# Altium schematic sheet SCH-9-Battery Voltage Indicators.SchDoc
size B
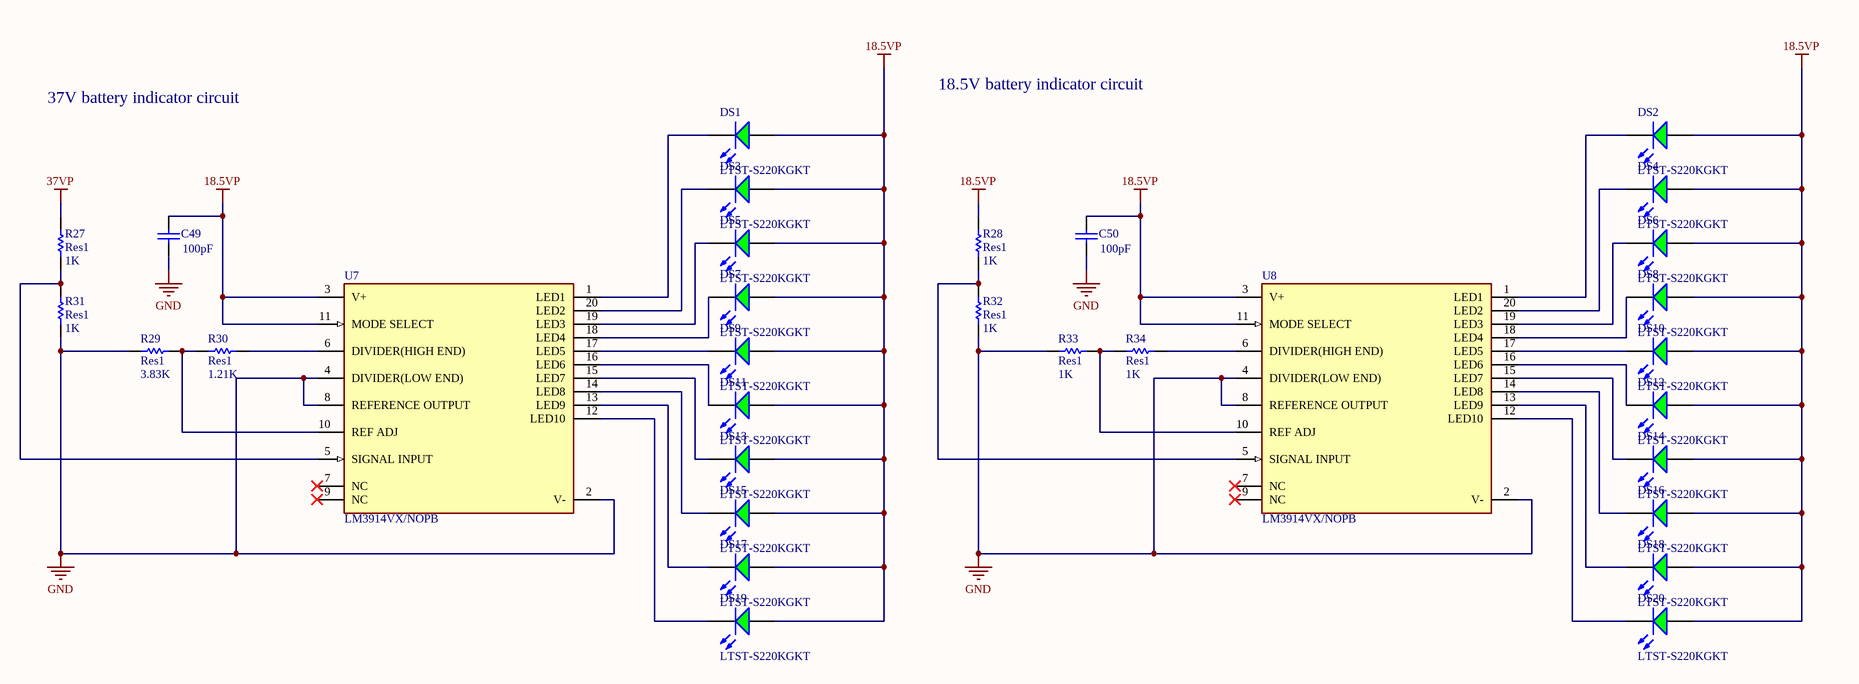
[diagram p0: SCH-9-Battery Voltage Indicators.SchDoc]

## Parts
C49  value 100pF  [C1206]  (hidden comment: Cap Semi)
C50  value 100pF  [C1206]  (hidden comment: Cap Semi)
DS1  LTST-S220KGKT  [LTST-S220KGKT_V]
DS2  LTST-S220KGKT  [LTST-S220KGKT_V]
DS3  LTST-S220KGKT  [LTST-S220KGKT_V]
DS4  LTST-S220KGKT  [LTST-S220KGKT_V]
DS5  LTST-S220KGKT  [LTST-S220KGKT_V]
DS6  LTST-S220KGKT  [LTST-S220KGKT_V]
DS7  LTST-S220KGKT  [LTST-S220KGKT_V]
DS8  LTST-S220KGKT  [LTST-S220KGKT_V]
DS9  LTST-S220KGKT  [LTST-S220KGKT_V]
DS10  LTST-S220KGKT  [LTST-S220KGKT_V]
DS11  LTST-S220KGKT  [LTST-S220KGKT_V]
DS12  LTST-S220KGKT  [LTST-S220KGKT_V]
DS13  LTST-S220KGKT  [LTST-S220KGKT_V]
DS14  LTST-S220KGKT  [LTST-S220KGKT_V]
DS15  LTST-S220KGKT  [LTST-S220KGKT_V]
DS16  LTST-S220KGKT  [LTST-S220KGKT_V]
DS17  LTST-S220KGKT  [LTST-S220KGKT_V]
DS18  LTST-S220KGKT  [LTST-S220KGKT_V]
DS19  LTST-S220KGKT  [LTST-S220KGKT_V]
DS20  LTST-S220KGKT  [LTST-S220KGKT_V]
R27  Res1  value 1K  [RESC1608X06N_0603]
R28  Res1  value 1K  [RESC1608X06N_0603]
R29  Res1  value 3.83K  [RESC1608X06N_0603]
R30  Res1  value 1.21K  [RESC1608X06N_0603]
R31  Res1  value 1K  [RESC1608X06N_0603]
R32  Res1  value 1K  [RESC1608X06N_0603]
R33  Res1  value 1K  [RESC1608X06N_0603]
R34  Res1  value 1K  [RESC1608X06N_0603]
U7  LM3914VX/NOPB  [FP-FN0020A-MFG]
U8  LM3914VX/NOPB  [FP-FN0020A-MFG]

## Nets
18.5VP: C49.2 C50.2 DS1.1(A) DS2.1(A) DS3.1(A) DS4.1(A) DS5.1(A) DS6.1(A) DS7.1(A) DS8.1(A) DS9.1(A) DS10.1(A) DS11.1(A) DS12.1(A) DS13.1(A) DS14.1(A) DS15.1(A) DS16.1(A) DS17.1(A) DS18.1(A) DS19.1(A) DS20.1(A) R28.2 U7.3(V+) U7.11(MODE_SELECT) U8.3(V+) U8.11(MODE_SELECT)
37VP: R27.2
GND: C49.1 C50.1 R29.1 R31.1 R32.1 R33.1 U7.2(V-) U7.4(DIVIDER(LOW_END)) U7.8(REFERENCE_OUTPUT) U8.2(V-) U8.4(DIVIDER(LOW_END)) U8.8(REFERENCE_OUTPUT)
NetDS1_2: DS1.2(K) U7.1(LED1)
NetDS2_2: DS2.2(K) U8.1(LED1)
NetDS3_2: DS3.2(K) U7.20(LED2)
NetDS4_2: DS4.2(K) U8.20(LED2)
NetDS5_2: DS5.2(K) U7.19(LED3)
NetDS6_2: DS6.2(K) U8.19(LED3)
NetDS7_2: DS7.2(K) U7.18(LED4)
NetDS8_2: DS8.2(K) U8.18(LED4)
NetDS9_2: DS9.2(K) U7.17(LED5)
NetDS10_2: DS10.2(K) U8.17(LED5)
NetDS11_2: DS11.2(K) U7.16(LED6)
NetDS12_2: DS12.2(K) U8.16(LED6)
NetDS13_2: DS13.2(K) U7.15(LED7)
NetDS14_2: DS14.2(K) U8.15(LED7)
NetDS15_2: DS15.2(K) U7.14(LED8)
NetDS16_2: DS16.2(K) U8.14(LED8)
NetDS17_2: DS17.2(K) U7.13(LED9)
NetDS18_2: DS18.2(K) U8.13(LED9)
NetDS19_2: DS19.2(K) U7.12(LED10)
NetDS20_2: DS20.2(K) U8.12(LED10)
NetR27_1: R27.1 R31.2 U7.5(SIGNAL_INPUT)
NetR28_1: R28.1 R32.2 U8.5(SIGNAL_INPUT)
NetR29_2: R29.2 R30.1 U7.10(REF_ADJ)
NetR30_2: R30.2 U7.6(DIVIDER(HIGH_END))
NetR33_2: R33.2 R34.1 U8.10(REF_ADJ)
NetR34_2: R34.2 U8.6(DIVIDER(HIGH_END))

Not connected (* = marked no-connect by the designer): U7 7(NC)* 9(NC)*; U8 7(NC)* 9(NC)*

## Notes on the sheet
- 18.5V battery indicator circuit
- 37V battery indicator circuit

## Library data of the parts
C49 C50 = Cap Semi: Capacitor (Semiconductor SIM Model); Published: 8-Jun-2000; LatestRevisionDate: 29-May-2009; LatestRevisionNote: IPC-7351 Footprint Added.; PackageReference: C1206; Publisher: Altium Limited; PackageDescription: Chip Capacitor
DS1-DS20 = CMP-2000-06628-1: LED Green, 75 mW, 30 mA, -30 to 85 degC, 2-Pin SMD, RoHS, Tape and Reel; Manufacturer: Lite-On; Chip Material: AlGaInP; Lum Intensity: 35mcd; Rad Hardened: No; Number of  Elements: 1; Forward Current: 30mA; Power Dissipation: 75W; Reverse Voltage: 5V; High Brightness: Yes; Test Current (It): 20mA; Dominant Wave Length: 571nm; Emitting Color: YellowGreen; Product Length (mm): 2.1mm; Peak Wavelength: 574nm; Product Depth (mm): 0.6mm; Type: Uni-Color; Main Category: ChipLED; Shape Type: Rectangular; DELETED: Compliant; Forward Voltage: 2.4V; Viewing Angle: 130deg; Product Height (mm): 1mm; Package Reference: S220KGKT; Operating Temp Range: -55Cto85C; Lens Dimensions: 1.7x0.6x0.5mm; Manufacturer URL: http://www.us.liteon.com/; Luminous Intensity: 35mcd; Datasheet URL: http://optoelectronics.liteon.com/upload/download/DS22-2000-075/S_110_LTST-S220KGKT.pdf; Package Type: ChipLed; Packaging: TapeandReel; Mounting Technology: SurfaceMount; Mounting: SurfaceMount; Operating Temperature Classification: Industrial; Package Description: 2-Pin Surface Mount Device, Body 2.15 x 0.6 mm; Datasheet Version: Rev. D, 12/2013; Pin Count: 2
R27-R34 = Res1: Resistor; Published: 8-Jun-2000; LatestRevisionDate: 17-Jul-2002; LatestRevisionNote: Re-released for DXP Platform.; PackageReference: AXIAL-0.3; Publisher: Altium Limited; PackageDescription: Axial Device, Thru-Hole; 2 Leads; 0.3 in Pin Spacing
U7 U8 = CMP-04914-000012-1: IC DRVR DOT/BAR DISPLAY 20PLCC; Manufacturer: Texas Instruments; Standoff Height: 0.51mm; Min Supply Voltage: 3V; Output Current: 10mA; Number Of Outputs: 10; Description: LED DRVR 10Segment 20-Pin PLCC T/R; Output Voltage: 1.28V; Max Supply Voltage: 15V; Automotive: No; Temperature: 0°C to +70°C; Device Class L2: Power Management ICs; Ipc Land Pattern Name: PLCC127P990X990X457-20; Octopart: https://octopart.com/lm3914vx%2Fnopb-texas+instruments-24814204; Height: 4.57mm; Package: FN0020A; Mouser Description: LED Lighting Drivers DOT/BAR DISPLAY DRVR; Temperature Range Low: 0°C; Category: IC; ComponentLink2URL: http://www.ti.com/lit/ds/symlink/lm3914.pdf; Digikey Description: IC DRVR DOT/BAR DISPLAY 20PLCC; Lead Free: Yes; Device Class L1: Integrated Circuits (ICs); RoHS: TRUE; Temperature Range High: +70°C; Device Class L3: LED Drivers; Manufacturer Part Number: LM3914VX/NOPB; ComponentLink2Description: Datasheet